# Altium schematic sheet MicroSD Card.SchDoc
size A4; SheetNumber: 5; SheetTotal: 8
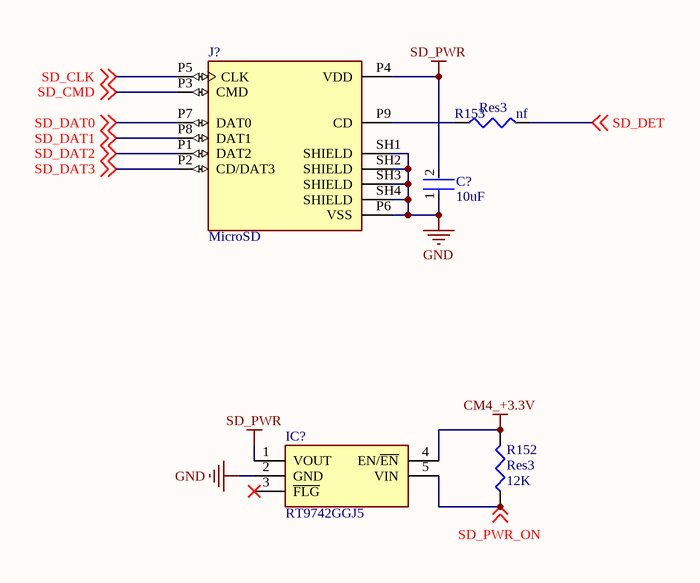
[diagram p0: MicroSD Card.SchDoc]

## Parts
C?  10uF  [FP-CC0603-DA-MFG]
IC?  RT9742GGJ5  [SOT94P280X100-5N]
J?  MicroSD  [GCT_MEM2075-00-140-01-A]
R152  Res3  value 12K  [J1-0603]
R153  Res3  value nf  [J1-0603]

## Nets
CM4_+3.3V: IC?.4(EN/~{EN}) R152.2
GND: C?.1 IC?.2(GND) J?.P6(VSS) J?.SH1(SHIELD) J?.SH2(SHIELD) J?.SH3(SHIELD) J?.SH4(SHIELD)
SD_PWR: C?.2 IC?.1(VOUT) J?.P4(VDD)
SD_CLK: J?.P5(CLK) ; off-sheet SD_CLK
SD_CMD: J?.P3(CMD) ; off-sheet SD_CMD
SD_DAT0: J?.P7(DAT0) ; off-sheet SD_DAT0
SD_DAT1: J?.P8(DAT1) ; off-sheet SD_DAT1
SD_DAT2: J?.P1(DAT2) ; off-sheet SD_DAT2
SD_DAT3: J?.P2(CD/DAT3) ; off-sheet SD_DAT3
SD_DET: R153.2 ; off-sheet SD_DET
SD_PWR_ON: IC?.5(VIN) R152.1 ; off-sheet SD_PWR_ON
NetJ?_P9: J?.P9(CD) R153.1

Not connected (* = marked no-connect by the designer): IC? 3(~{FLG})*

## Library data of the parts
C? = CMP-03422-000924-1: CAP CER 1UF 16V X7R 0603; Manufacturer: YAGEO; Manufacturer Part Number: CC0603KRX7R7BB105; Tolerance: 0.1; Temperature Coefficient: 15%; Material: Ceramic; Package: CC0603-DA; RoHS: TRUE; Device Class L2: Capacitors; Temperature Characteristic: X7R; Temperature: -55°C to +125°C; Temperature Range Low: -55°C; Automotive: No; ComponentLink2Description: Datasheet; Value: 1 uF; Lead Free: Yes; Capacitance: 1 uF; ComponentLink2URL: http://www.yageo.com/documents/recent/UPY-GPHC_X7R_6.3V-to-50V_18.pdf; Device Class L1: Passive Components; Voltage: 16 V; Octopart: https://octopart.com/cc0603krx7r7bb105-yageo-42271928; Category: Cap; Digikey Description: CAP CER 1UF 16V X7R 0603; Footprint Url: http://www.yageo.com/exep/pages/download/literatures/UPY-C_GEN_24.pdf; Height: 0.9mm; Voltage Rating: 16 V; Temperature Range High: +125°C; Mouser Description: Multilayer Ceramic Capacitor, CC Series, 1 - F, - 10%, X7R, 16 V, 0603 [1608 Metric]; Device Class L3: Ceramic Capacitors
IC? = RT9742GGJ5: Integrated Circuit; Manufacturer_Name: RICHTEK; Datasheet Link: https://componentsearchengine.com/Datasheets/2/RT9742GGJ5.pdf; Height: 1mm; Manufacturer_Part_Number: RT9742GGJ5
J? = MEM2075-00-140-01-A: 9 _8 + 1_ Position Card Connector microSDâ„¢ Surface Mount, Right Angle Gold; MF: Global Connector Technology; Availability: Unavailable; Price: None; SnapEDA_Link: https://www.snapeda.com/parts/MEM2075-00-140-01-A/Global%20Connector%20Technology/view-part/2680480/?ref=snap; Value: *; Package: Package Analog Devices; MP: MEM2075-00-140-01-A
R152 R153 = Res3: Resistor; Published: 8-Jun-2000; LatestRevisionDate: 29-May-2009; LatestRevisionNote: IPC-7351 Footprint Added.; PackageReference: J1-0603; Publisher: Altium Limited; PackageDescription: Chip Resistor